# Altium schematic sheet bal2un.SchDoc
size A4
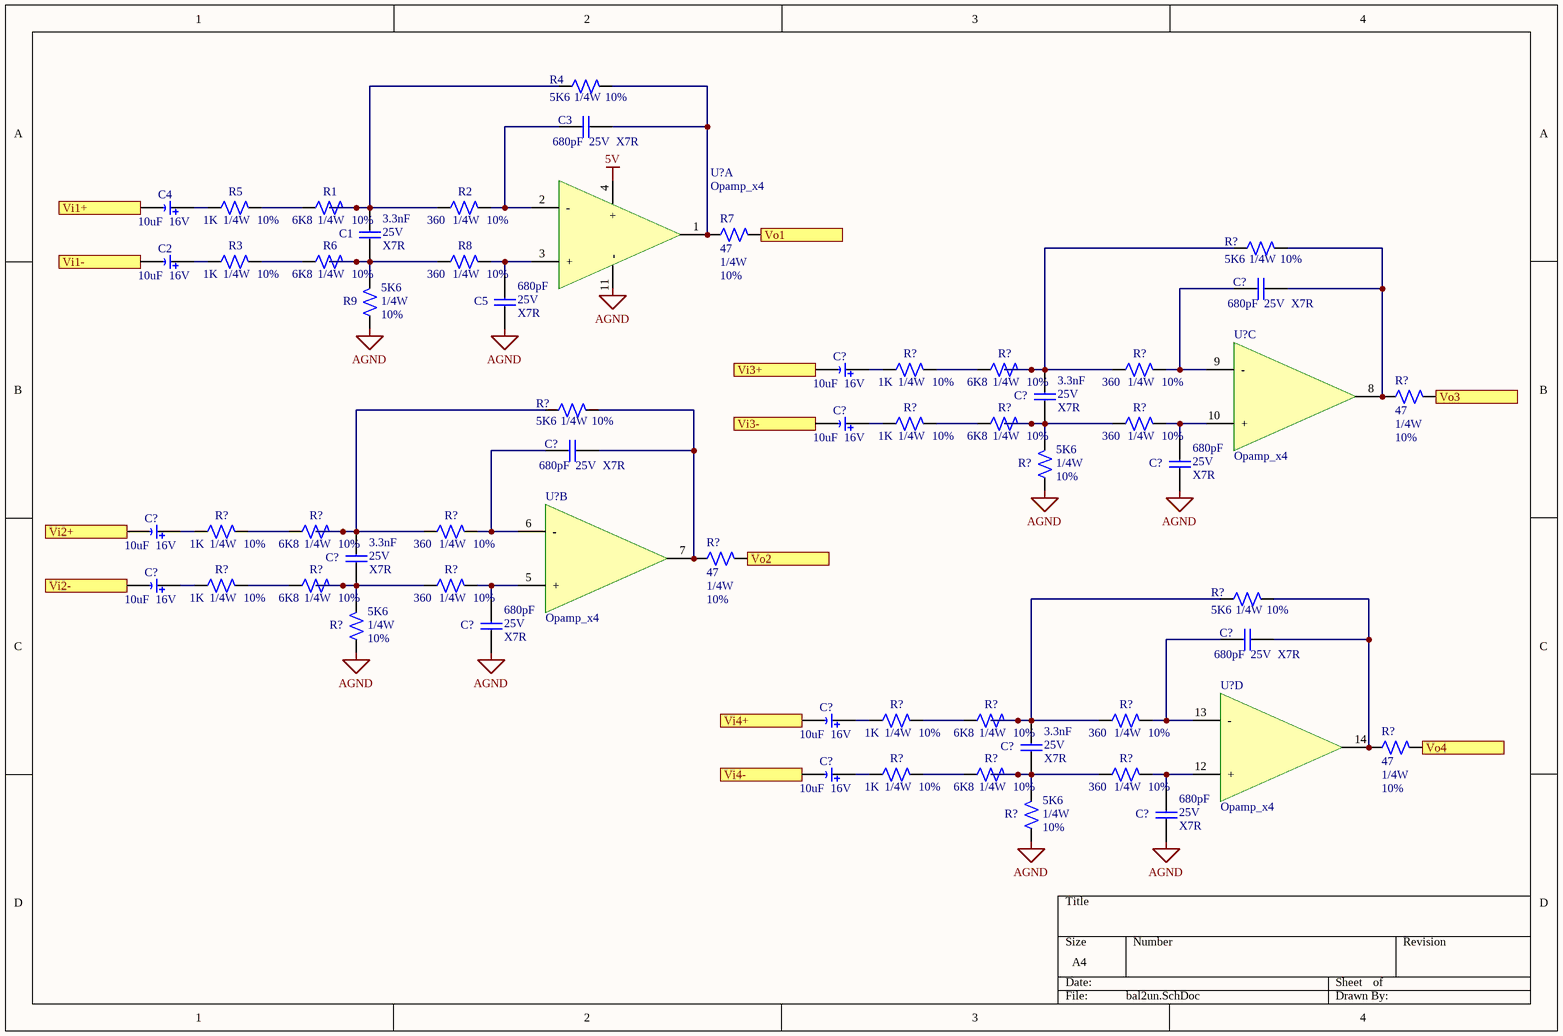
[diagram p0: bal2un.SchDoc]

## Parts
(Parts that share a designator on the sheet are numbered #1, #2 ... from top to bottom, then left to right.)
C1  valor: 3.3nF  tension: 25V  tolerancia: X7R  [C0805]  (hidden comment: Capacitor)
C2  valor: 10uF  tension: 16V  [AVX_C]  (hidden comment: Capacitor polarizado)
C3  valor: 680pF  tension: 25V  tolerancia: X7R  [C0805]  (hidden comment: Capacitor)
C4  valor: 10uF  tension: 16V  [AVX_C]  (hidden comment: Capacitor polarizado)
C5  valor: 680pF  tension: 25V  tolerancia: X7R  [C0805]  (hidden comment: Capacitor)
C?#1  valor: 680pF  tension: 25V  tolerancia: X7R  [C0805]  (hidden comment: Capacitor)
C?#2  valor: 10uF  tension: 16V  [AVX_C]  (hidden comment: Capacitor polarizado)
C?#3  valor: 3.3nF  tension: 25V  tolerancia: X7R  [C0805]  (hidden comment: Capacitor)
C?#4  valor: 10uF  tension: 16V  [AVX_C]  (hidden comment: Capacitor polarizado)
C?#5  valor: 680pF  tension: 25V  tolerancia: X7R  [C0805]  (hidden comment: Capacitor)
C?#6  valor: 680pF  tension: 25V  tolerancia: X7R  [C0805]  (hidden comment: Capacitor)
C?#7  valor: 10uF  tension: 16V  [AVX_C]  (hidden comment: Capacitor polarizado)
C?#8  valor: 3.3nF  tension: 25V  tolerancia: X7R  [C0805]  (hidden comment: Capacitor)
C?#9  valor: 10uF  tension: 16V  [AVX_C]  (hidden comment: Capacitor polarizado)
C?#10  valor: 680pF  tension: 25V  tolerancia: X7R  [C0805]  (hidden comment: Capacitor)
C?#11  valor: 680pF  tension: 25V  tolerancia: X7R  [C0805]  (hidden comment: Capacitor)
C?#12  valor: 10uF  tension: 16V  [AVX_C]  (hidden comment: Capacitor polarizado)
C?#13  valor: 3.3nF  tension: 25V  tolerancia: X7R  [C0805]  (hidden comment: Capacitor)
C?#14  valor: 10uF  tension: 16V  [AVX_C]  (hidden comment: Capacitor polarizado)
C?#15  valor: 680pF  tension: 25V  tolerancia: X7R  [C0805]  (hidden comment: Capacitor)
R1  Valor: 6K8  Potencia: 1/4W  Tolerancia: 10%  [R0603]  (hidden comment: Resistor)
R2  Valor: 360  Potencia: 1/4W  Tolerancia: 10%  [R0603]  (hidden comment: Resistor)
R3  Valor: 1K  Potencia: 1/4W  Tolerancia: 10%  [R0603]  (hidden comment: Resistor)
R4  Valor: 5K6  Potencia: 1/4W  Tolerancia: 10%  [R0603]  (hidden comment: Resistor)
R5  Valor: 1K  Potencia: 1/4W  Tolerancia: 10%  [R0603]  (hidden comment: Resistor)
R6  Valor: 6K8  Potencia: 1/4W  Tolerancia: 10%  [R0603]  (hidden comment: Resistor)
R7  Valor: 47  Potencia: 1/4W  Tolerancia: 10%  [R0603]  (hidden comment: Resistor)
R8  Valor: 360  Potencia: 1/4W  Tolerancia: 10%  [R0603]  (hidden comment: Resistor)
R9  Valor: 5K6  Potencia: 1/4W  Tolerancia: 10%  [R0603]  (hidden comment: Resistor)
R?#1  Valor: 5K6  Potencia: 1/4W  Tolerancia: 10%  [R0603]  (hidden comment: Resistor)
R?#2  Valor: 1K  Potencia: 1/4W  Tolerancia: 10%  [R0603]  (hidden comment: Resistor)
R?#3  Valor: 6K8  Potencia: 1/4W  Tolerancia: 10%  [R0603]  (hidden comment: Resistor)
R?#4  Valor: 360  Potencia: 1/4W  Tolerancia: 10%  [R0603]  (hidden comment: Resistor)
R?#5  Valor: 47  Potencia: 1/4W  Tolerancia: 10%  [R0603]  (hidden comment: Resistor)
R?#6  Valor: 5K6  Potencia: 1/4W  Tolerancia: 10%  [R0603]  (hidden comment: Resistor)
R?#7  Valor: 1K  Potencia: 1/4W  Tolerancia: 10%  [R0603]  (hidden comment: Resistor)
R?#8  Valor: 6K8  Potencia: 1/4W  Tolerancia: 10%  [R0603]  (hidden comment: Resistor)
R?#9  Valor: 360  Potencia: 1/4W  Tolerancia: 10%  [R0603]  (hidden comment: Resistor)
R?#10  Valor: 5K6  Potencia: 1/4W  Tolerancia: 10%  [R0603]  (hidden comment: Resistor)
R?#11  Valor: 1K  Potencia: 1/4W  Tolerancia: 10%  [R0603]  (hidden comment: Resistor)
R?#12  Valor: 6K8  Potencia: 1/4W  Tolerancia: 10%  [R0603]  (hidden comment: Resistor)
R?#13  Valor: 360  Potencia: 1/4W  Tolerancia: 10%  [R0603]  (hidden comment: Resistor)
R?#14  Valor: 47  Potencia: 1/4W  Tolerancia: 10%  [R0603]  (hidden comment: Resistor)
R?#15  Valor: 1K  Potencia: 1/4W  Tolerancia: 10%  [R0603]  (hidden comment: Resistor)
R?#16  Valor: 6K8  Potencia: 1/4W  Tolerancia: 10%  [R0603]  (hidden comment: Resistor)
R?#17  Valor: 360  Potencia: 1/4W  Tolerancia: 10%  [R0603]  (hidden comment: Resistor)
R?#18  Valor: 5K6  Potencia: 1/4W  Tolerancia: 10%  [R0603]  (hidden comment: Resistor)
R?#19  Valor: 5K6  Potencia: 1/4W  Tolerancia: 10%  [R0603]  (hidden comment: Resistor)
R?#20  Valor: 1K  Potencia: 1/4W  Tolerancia: 10%  [R0603]  (hidden comment: Resistor)
R?#21  Valor: 6K8  Potencia: 1/4W  Tolerancia: 10%  [R0603]  (hidden comment: Resistor)
R?#22  Valor: 360  Potencia: 1/4W  Tolerancia: 10%  [R0603]  (hidden comment: Resistor)
R?#23  Valor: 47  Potencia: 1/4W  Tolerancia: 10%  [R0603]  (hidden comment: Resistor)
R?#24  Valor: 1K  Potencia: 1/4W  Tolerancia: 10%  [R0603]  (hidden comment: Resistor)
R?#25  Valor: 6K8  Potencia: 1/4W  Tolerancia: 10%  [R0603]  (hidden comment: Resistor)
R?#26  Valor: 360  Potencia: 1/4W  Tolerancia: 10%  [R0603]  (hidden comment: Resistor)
R?#27  Valor: 5K6  Potencia: 1/4W  Tolerancia: 10%  [R0603]  (hidden comment: Resistor)
U?#1  Opamp_x4  [TSSOP-14]  (part A of 4)
U?#2  Opamp_x4  [TSSOP-14]  (part C of 4)
U?#3  Opamp_x4  [TSSOP-14]  (part B of 4)
U?#4  Opamp_x4  [TSSOP-14]  (part D of 4)

## Ports
Vi1+ (in), Vi1- (in), Vi2+ (in), Vi2- (in), Vi3+ (in), Vi3- (in), Vi4+ (in), Vi4- (in), Vo1 (out), Vo2 (out), Vo3 (out), Vo4 (out)

## Nets
5V: U?#1.4(+)
AGND: C5.2 C?#6.2 C?#10.2 C?#15.2 R9.1 R?#10.1 R?#19.1 R?#27.1 U?#1.11(-)
Vi1+: C4.2 ; port Vi1+
Vi1-: C2.2 ; port Vi1-
Vi2+: C?#7.2 ; port Vi2+
Vi2-: C?#9.2 ; port Vi2-
Vi3+: C?#2.2 ; port Vi3+
Vi3-: C?#4.2 ; port Vi3-
Vi4+: C?#12.2 ; port Vi4+
Vi4-: C?#14.2 ; port Vi4-
Vo1: R7.2 ; port Vo1
Vo2: R?#14.2 ; port Vo2
Vo3: R?#5.2 ; port Vo3
Vo4: R?#23.2 ; port Vo4
NetC1_1: C1.1 R1.2 R2.1 R4.1
NetC1_2: C1.2 R6.2 R8.1 R9.2
NetC2_1: C2.1 R3.1
NetC3_1: C3.1 R4.2 R7.1 U?#1.1(OUT)
NetC3_2: C3.2 R2.2 U?#1.2(-)
NetC4_1: C4.1 R5.1
NetC5_1: C5.1 R8.2 U?#1.3(+)
NetC?#1_1: C?#1.1 R?#1.2 R?#5.1 U?#2.8(OUT)
NetC?#1_2: C?#1.2 R?#4.2 U?#2.9(-)
NetC?#2_1: C?#2.1 R?#2.1
NetC?#3_1: C?#3.1 R?#1.1 R?#3.2 R?#4.1
NetC?#3_2: C?#3.2 R?#8.2 R?#9.1 R?#10.2
NetC?#4_1: C?#4.1 R?#7.1
NetC?#5_1: C?#5.1 R?#6.2 R?#14.1 U?#3.7(OUT)
NetC?#5_2: C?#5.2 R?#13.2 U?#3.6(-)
NetC?#6_1: C?#6.1 R?#9.2 U?#2.10(+)
NetC?#7_1: C?#7.1 R?#11.1
NetC?#8_1: C?#8.1 R?#6.1 R?#12.2 R?#13.1
NetC?#8_2: C?#8.2 R?#16.2 R?#17.1 R?#19.2
NetC?#9_1: C?#9.1 R?#15.1
NetC?#10_1: C?#10.1 R?#17.2 U?#3.5(+)
NetC?#11_1: C?#11.1 R?#18.2 R?#23.1 U?#4.14(OUT)
NetC?#11_2: C?#11.2 R?#22.2 U?#4.13(-)
NetC?#12_1: C?#12.1 R?#20.1
NetC?#13_1: C?#13.1 R?#18.1 R?#21.2 R?#22.1
NetC?#13_2: C?#13.2 R?#25.2 R?#26.1 R?#27.2
NetC?#14_1: C?#14.1 R?#24.1
NetC?#15_1: C?#15.1 R?#26.2 U?#4.12(+)
NetR1_1: R1.1 R5.2
NetR3_2: R3.2 R6.1
NetR?#2_2: R?#2.2 R?#3.1
NetR?#7_2: R?#7.2 R?#8.1
NetR?#11_2: R?#11.2 R?#12.1
NetR?#15_2: R?#15.2 R?#16.1
NetR?#20_2: R?#20.2 R?#21.1
NetR?#24_2: R?#24.2 R?#25.1

## Library data of the parts
C1 C3 C5 C?#1 C?#3 C?#5 C?#6 C?#8 C?#10 C?#11 C?#13 C?#15 = Capacitor: Capacitor de placas paralelas; Encapsulado: 0805
R1-R9 R?#1-R?#27 = Resistor: Resistencia
U?#1-U?#4 = Opamp_x4: Integrado con 4 operacionales